# Altium schematic sheet TSAL.SchDoc
size A
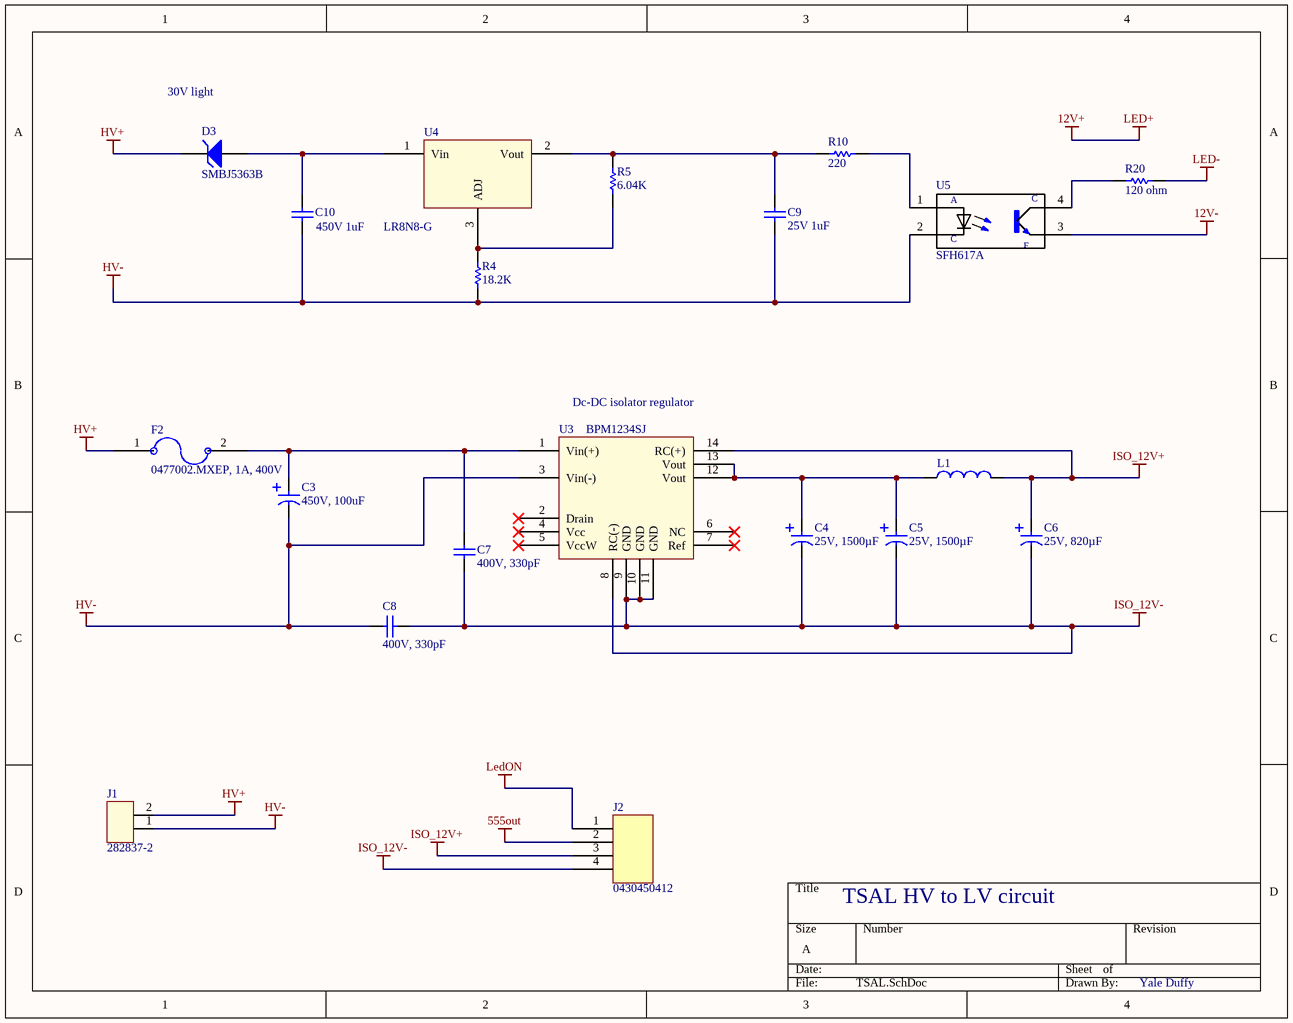
[diagram p0: TSAL.SchDoc]

## Parts
C3  450V, 100uF  [450BXW100MEFR18X30]
C4  25V, 1500µF  [25ZLS1500MEFC12.5X20]
C5  25V, 1500µF  [25ZLS1500MEFC12.5X20]
C6  25V, 820µF  [ESY827M025AH5AA]
C7  400V, 330pF  [DE2B3SA331KN3AY02F]
C8  400V, 330pF  [DE2B3SA331KN3AY02F]
C9  25V 1uF  [C0603C105K3RACTU]
C10  450V 1uF  [CKG57KX7T2W105K335JH]
D3  SMBJ5363B  [214AA]
F2  0477002.MXEP, 1A, 400V  [0477002.MXEP]
J1  282837-2  [282837-2]
J2  0430450412  [0430450412]
L1  1267AY-2R2N=P3  [1267AY2R2NP3]  (value not drawn)
R4  18.2K  [Resistor 0603]
R5  6.04K  [Resistor 0603]
R10  220  [Resistor 0603]
R20  120 ohm  [Resistor 0603]
U3  BPM1234SJ  [BPM1234SJ]
U4  LR8N8-G  [TO-243AA(SOT-89-3)]
U5  SFH617A  [SFH617A]

## Nets
12V-: U5.3(E)
555out: J2.2
HV+: D3.1(K) F2.1 J1.2
HV-: C3.1 C8.2 C9.1 C10.1 J1.1 R4.2 U3.3(Vin(-)) U5.2(C)
ISO_12V+: C6.2 J2.3 L1.2 U3.14(RC(+))
ISO_12V-: C4.1 C5.1 C6.1 C7.1 C8.1 J2.4 U3.8(RC(-)) U3.9(GND) U3.10(GND) U3.11(GND)
LED-: R20.2
LedON: J2.1
NetC3_2: C3.2 C7.2 F2.2 U3.1(Vin(+))
NetC4_2: C4.2 C5.2 L1.1 U3.12(Vout) U3.13(Vout)
NetC9_2: C9.2 R5.1 R10.1 U4.2(Vout)
NetC10_2: C10.2 D3.2(A) U4.1(Vin)
NetR4_1: R4.1 R5.2 U4.3(ADJ)
NetR10_2: R10.2 U5.1(A)
NetR20_1: R20.1 U5.4(CO)

Not connected (* = marked no-connect by the designer): U3 2(Drain)* 4(Vcc)* 5(VccW)* 6(NC)* 7(Ref)*

## Notes on the sheet
- 30V light
- (near U3) Dc-DC isolator regulator
- TSAL HV to LV circuit
- Yale Duffy

## Library data of the parts
C3 = 450BXW100MEFR18X30: Capacitors, Radial, Can, 100µF 450V Aluminum; ComponentLink1Description: Datasheet; ComponentLink1URL: http://www.rubycon.co.jp/en/catalog/e_pdfs/aluminum/e_BXW.pdf; ComponentLink2Description: Supplier; ComponentLink2URL: https://www.digikey.com/product-detail/en/rubycon/450BXW100MEFR18X30/1189-3221-ND/6050094
C4 C5 = 25ZLS1500MEFC12.5X20: Capacitors, Aluminum Electrolytic, Radial, Can, 1500µF, 25V; ComponentLink1Description: Datasheet; ComponentLink1URL: http://www.rubycon.co.jp/en/catalog/e_pdfs/aluminum/e_zls.pdf; ComponentLink2Description: Supplier; ComponentLink2URL: https://www.digikey.com/product-detail/en/rubycon/25ZLS1500MEFC12.5X20/1189-2590-ND/4977137
C6 = ESY827M025AH5AA: Capacitors Radial, Can, 820µF 25V Aluminum Electrolytic, 23mOhm @ 100kHz 4000 Hrs @ 105°C; ComponentLink1Description: Datasheet; ComponentLink1URL: https://content.kemet.com/datasheets/KEM_A4007_ESY.pdf; ComponentLink2Description: Supplier; ComponentLink2URL: https://www.digikey.com/product-detail/en/kemet/ESY827M025AH5AA/399-6647-ND/3083062
C7 C8 = DE2B3SA331KN3AY02F: Capacitor, 330pF ±10% 400VAC Ceramic Capacitor B Radial, Disc
C9 = C0603C105K3RACTU: Capacitor, Ceramic, 1 uF, 25 V, ±10% SMT, 0603; ComponentLink1Description: Datasheet; ComponentLink1URL: https://content.kemet.com/datasheets/KEM_C1002_X7R_SMD.pdf; ComponentLink2Description: Supplier; ComponentLink2URL: https://www.digikey.com/product-detail/en/kemet/C0603C105K3RACTU/399-7376-1-ND/3317410
C10 = CKG57KX7T2W105K335JH: Decoupling capacitor; ComponentLink1Description: Datasheet; ComponentLink1URL: https://product.tdk.com/info/en/catalog/datasheets/mlcc_commercial_megacap_en.pdf; ComponentLink2Description: Supplier; ComponentLink2URL: https://www.digikey.com/product-detail/en/tdk-corporation/CKG57KX7T2W105K335JH/445-10489-1-ND/3932416
D3 = SMBJ5363B: Diode Zener 30V 5W ±5% Surface Mount DO-214AA (SMB)
F2 = 0477002.MXEP: Fuse, 2A 500V AC 400V DC Fuse Cartridge, Ceramic Through Hole 5mm x 20mm (Axial)
J1 = 282837-2: Connector Terminal Blocks Receptacle 2 Position 5.08mm Solder Straight Thru-Hole 13.5A/Contact
J2 = 0430450412: Connector Header Through Hole 4 position 0.118" (3.00mm); ComponentLink1Description: Datasheet; ComponentLink1URL: https://www.molex.com/pdm_docs/sd/430450412_sd.pdf; ComponentLink2Description: Supplier; ComponentLink2URL: https://www.digikey.com/product-detail/en/molex/0430450412/WM1790-ND/252503
L1 = 1267AY-2R2N=P3: Shielded Wirewound Inductor, 2.2µH ,7.4A 13.2mOhm Max Nonstandard; ComponentLink1Description: Datasheet; ComponentLink1URL: https://www.murata.com/~/media/webrenewal/products/inductor/chip/tokoproducts/wirewoundferritetypeforpl/m_dg8040c.ashx?la=en; ComponentLink2Description: Supplier; ComponentLink2URL: https://www.digikey.com/product-detail/en/murata-electronics/1267AY-2R2N=P3/490-10831-2-ND/5271472
R4 = ERJ-3EKF1822V: Resistor, 18.2K ohms, 0603, SMD
R5 = ERJ-3EKF6041V: Resistor, 6.04 kOhms ±1% 0.1W, 1/10W Chip Resistor 0603 (1608 Metric) Automotive AEC-Q200 Thick Film; ComponentLink1Description: Supplier; ComponentLink1URL: https://www.digikey.com/product-detail/en/panasonic-electronic-components/ERJ-3EKF6041V/P6.04KHCT-ND/198452
R10 = ERJ-3EKF2200V: Resistor, 220 ohm, 0603
R20 = ERJ-3EKF1200V: Resistor, 120 ohms, 0603, SMD
U3 = BPM1234SJ: Isolated DC-DC converters, 12 V, 3.4A; ComponentLink1Description: Datasheet; ComponentLink1URL: https://www.mouser.com/datasheet/2/397/BPM1234SJ_1612EE-1272167.pdf; ComponentLink2Description: Supplier; ComponentLink2URL: https://www.mouser.com/ProductDetail/Tamura/BPM1234SJ?qs=JtOM4tvdyp3RA%2FViNUppcg%3D%3D
U4 = LR8N8-G: Voltage Regulator, Linear, input max 480V, output 1.2V - 440V, TO-243AA , SMD; ComponentLink1Description: Datasheet; ComponentLink1URL: https://www.mouser.com/datasheet/2/268/20005399A-909415.pdf; ComponentLink2Description: Supplier; ComponentLink2URL: https://www.digikey.com/product-detail/en/microchip-technology/LR8N8-G/LR8N8-GCT-ND/4918747
U5 = SFH617A: opto-Isolator; ComponentLink1Description: Datasheet; ComponentLink1URL: http://www.vishay.com/docs/83740/sfh617a.pdf; ComponentLink2Description: Supplier; ComponentLink2URL: https://www.digikey.com/product-detail/en/vishay-semiconductor-opto-division/SFH617A-2X017T/SFH617A-2X017TCT-ND/8556837